# EAGLE board HYBRID_COMPUTER (EAGLE 7.7.0), part 1 of 2
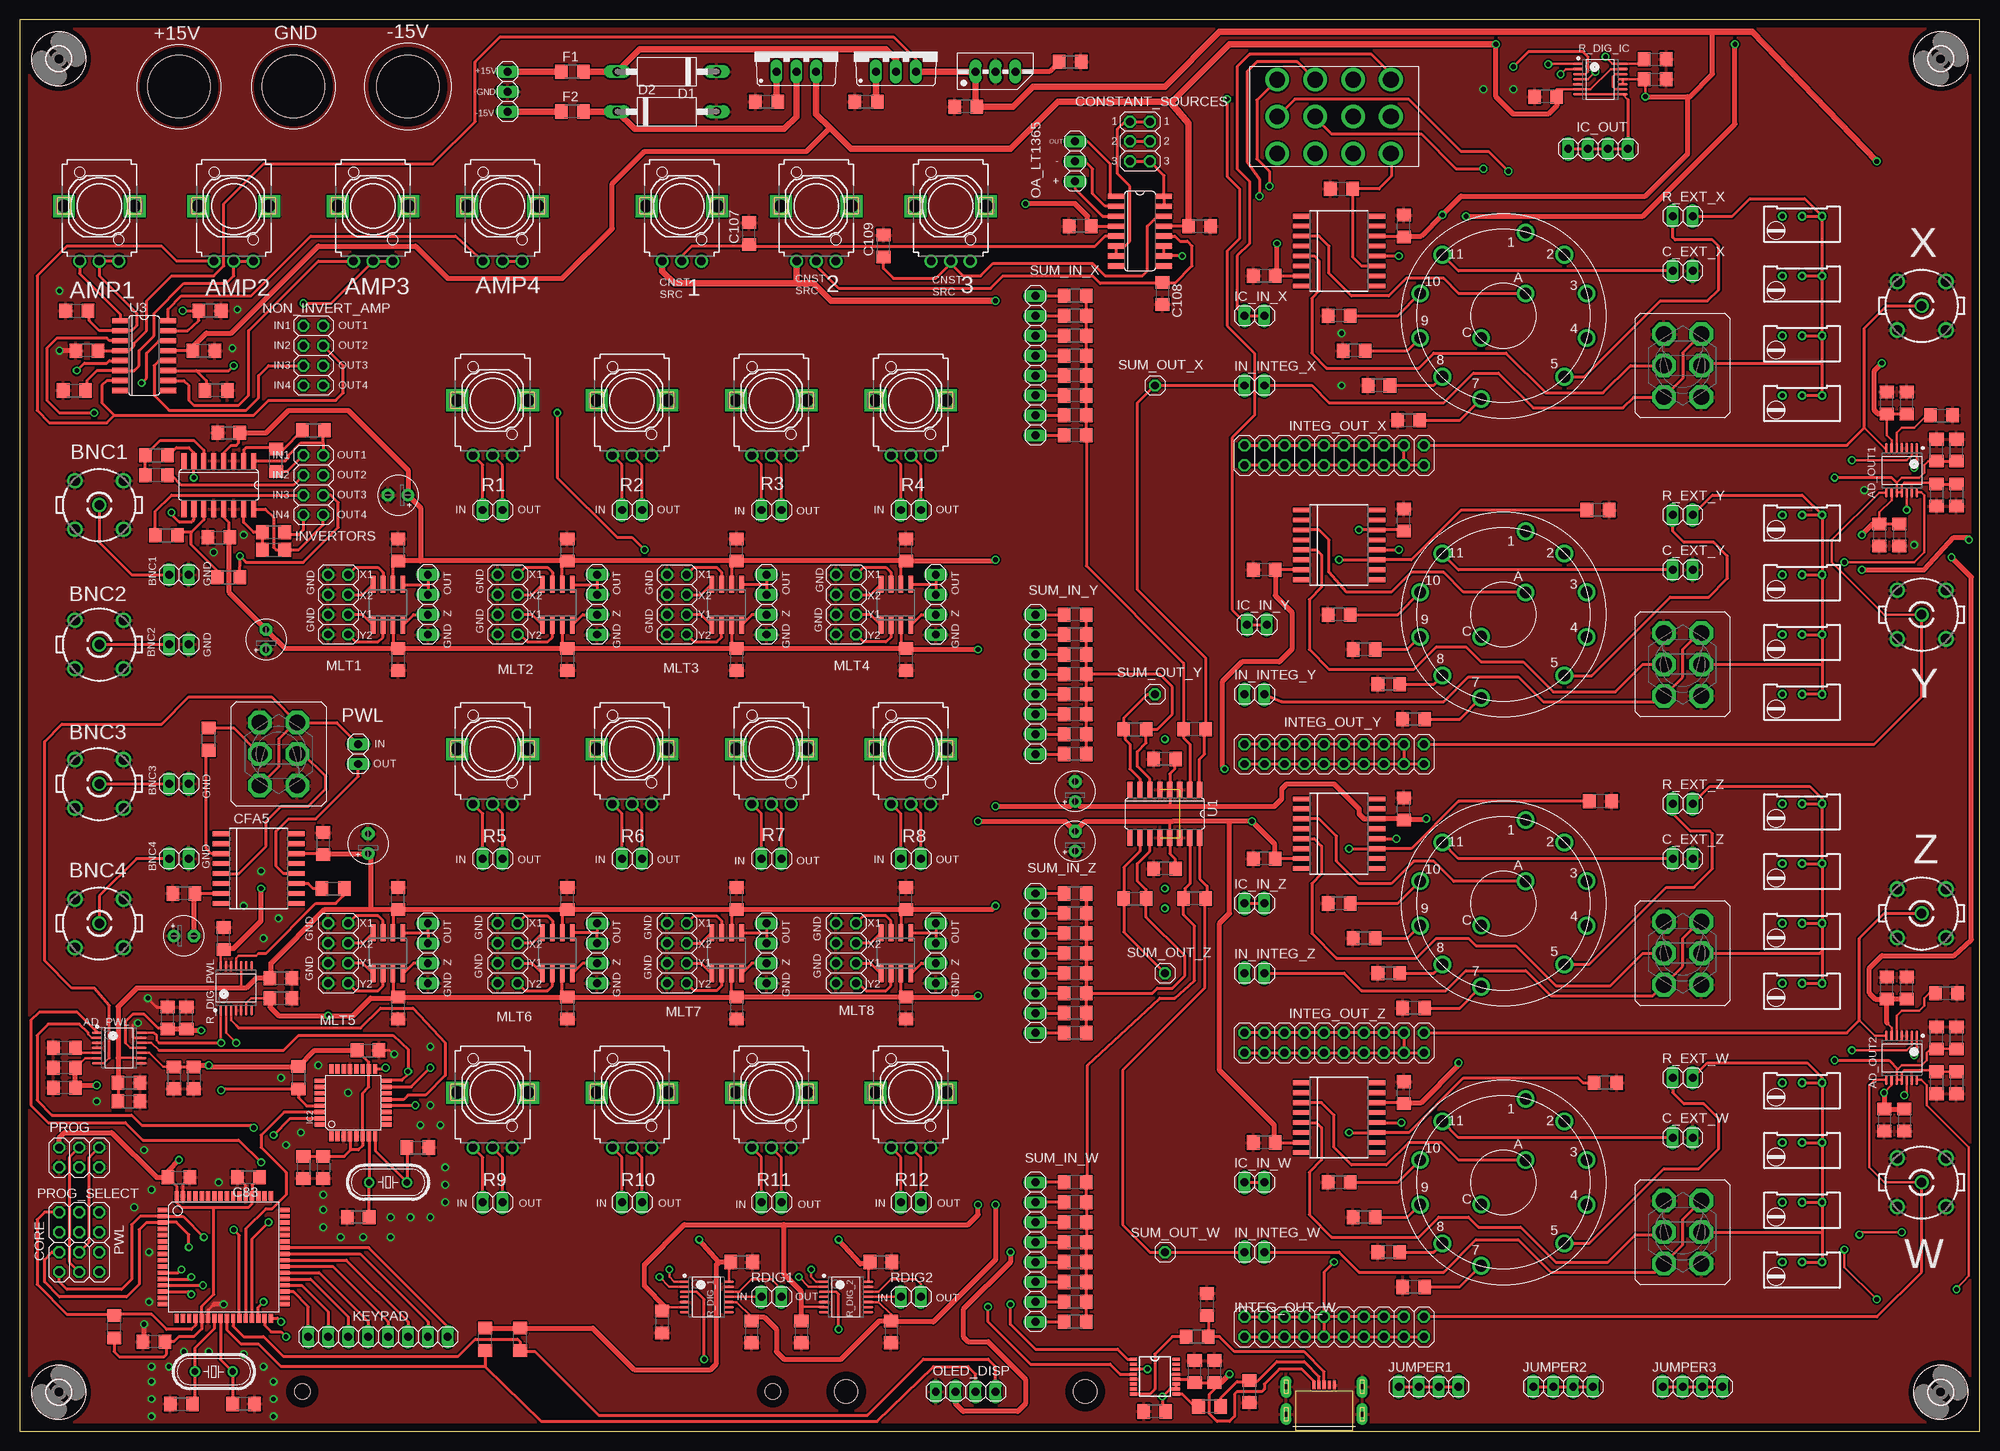
[diagram p2: board, top side]
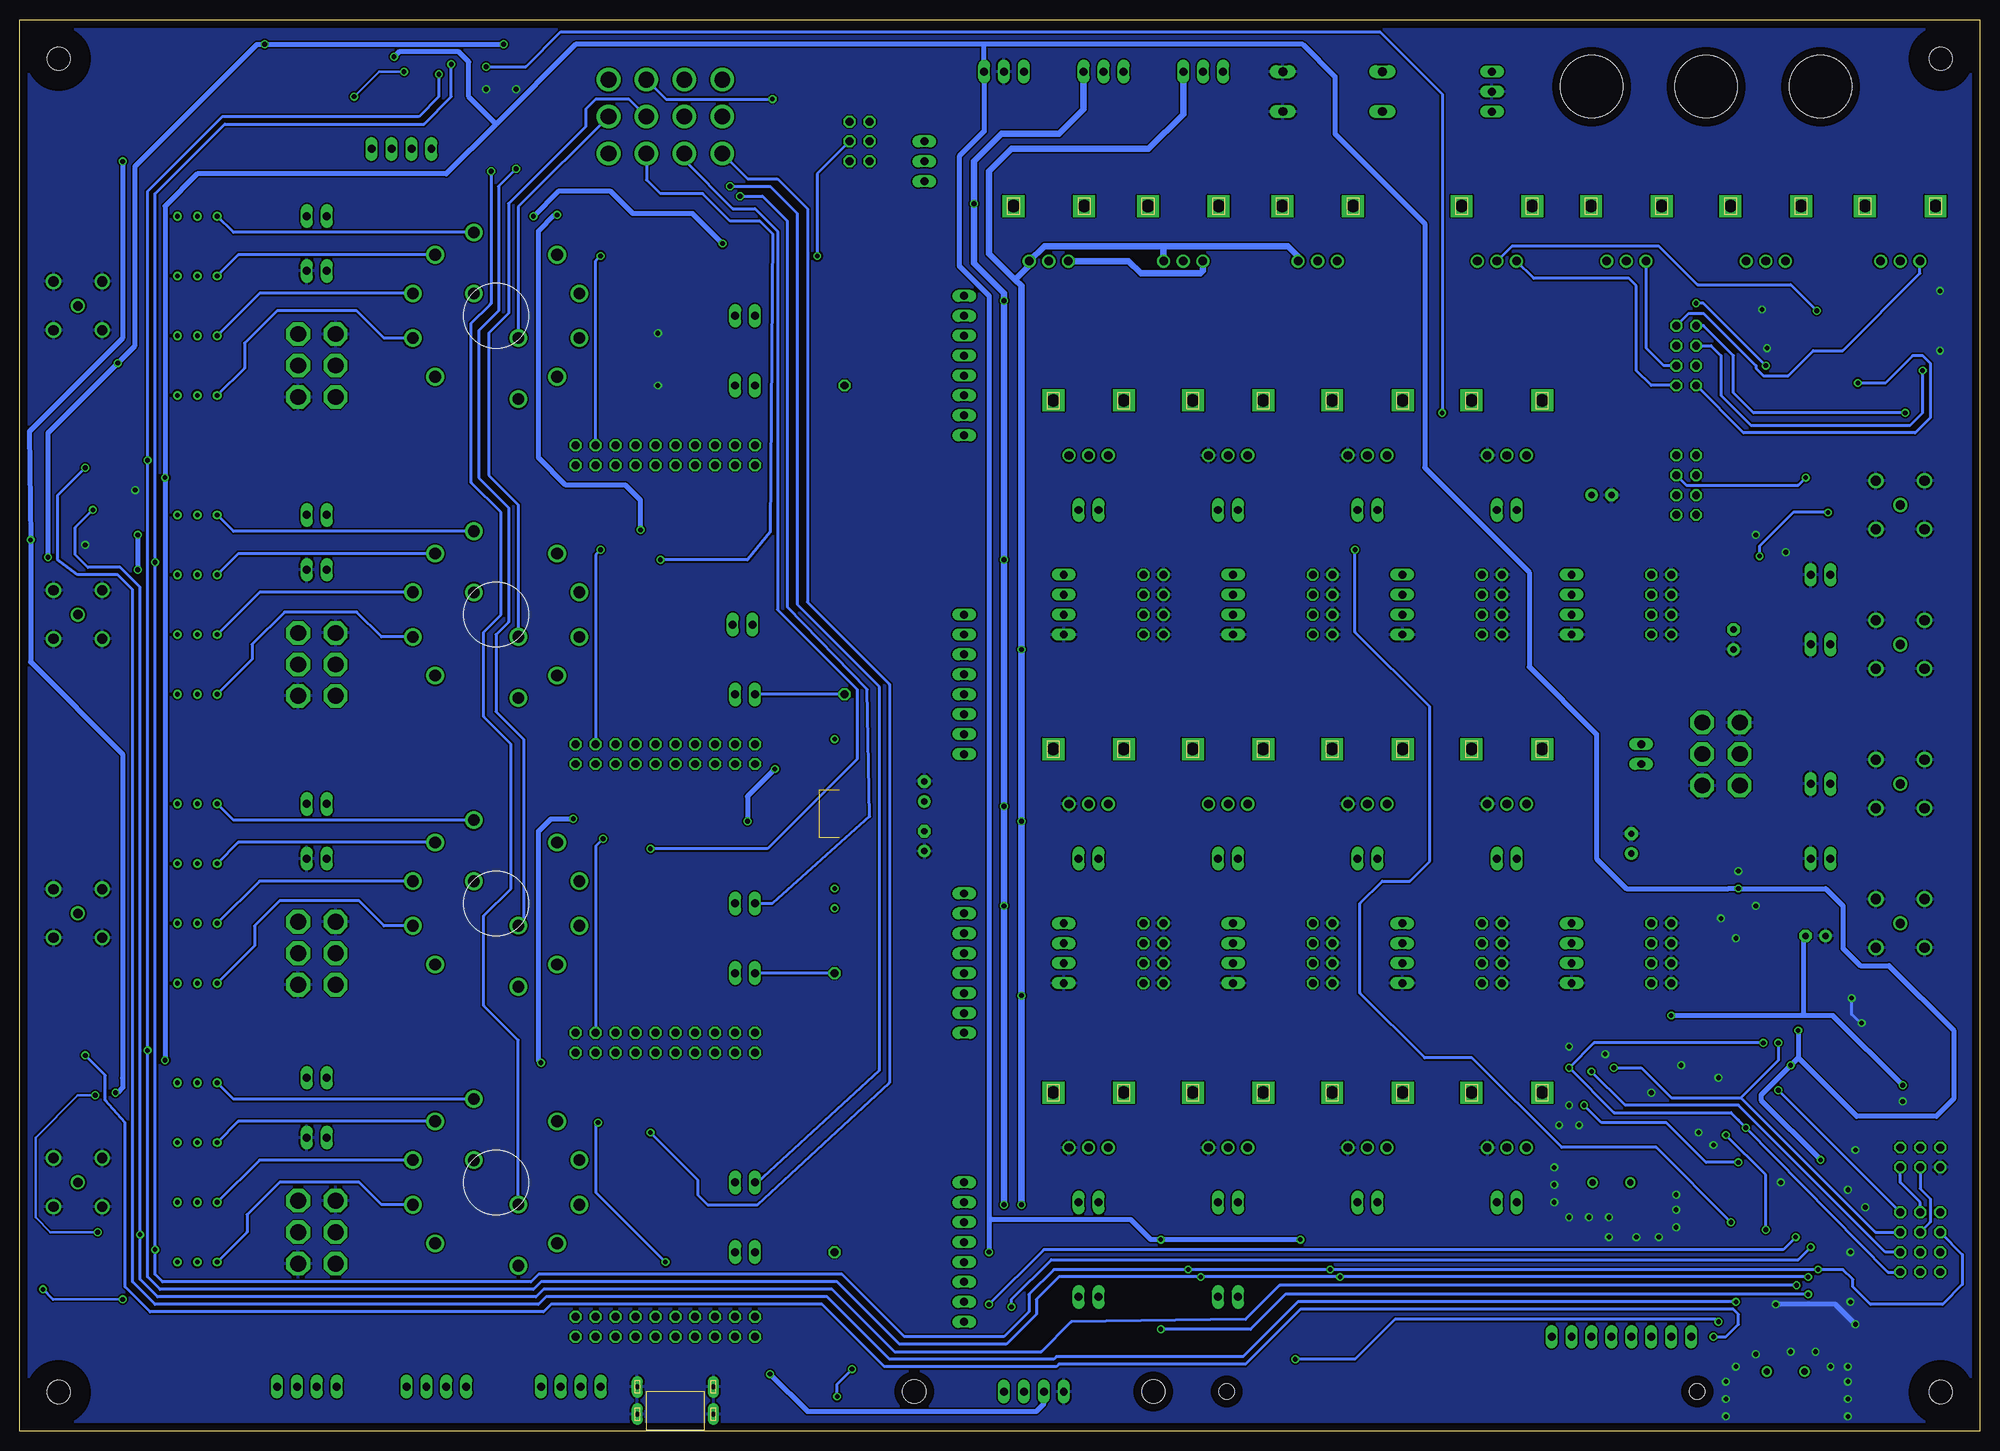
[diagram p3: board, bottom side, seen from below]

Size 250 x 180 mm. Coordinates in mm from the lower left corner, seen from the top.
Outline: 0,0 250,0 250,180 0,180 0,0
Copper layers (1*16): Top 0.035mm / dielectric 1.5mm / Bottom 0.035mm
Design rules "default": minimum track width 10mil, minimum drill 24mil, track to track 8mil, track to pad 8mil, pad to pad 8mil, via to via 8mil, smd to smd 8mil, copper to edge 40mil, drill to drill 8mil, minimum pad ring 10mil, minimum via ring 8mil, stop-mask expansion 4mil, vias tented up to drill 0mil, thermal gap 10mil
Holes 8 mm at 20.32,171.45 34.92,171.45 49.53,171.45
Holes 3 mm at 105.4,5.08 135.9,5.08
Holes 2 mm at 36.04,5.08 96.04,5.08

## Footprints (pad centres in the part's own frame; a part is rotated, then mirrored left to right if it is on the bottom)
TSSOP-14 = smd 1.3 x 0.35: 1 -2.825,1.95; 2 -2.825,1.3; 3 -2.825,0.65; 4 -2.825,0; 5 -2.825,-0.65; 6 -2.825,-1.3; 7 -2.825,-1.95; 8 2.825,-1.95; 9 2.825,-1.3; 10 2.825,-0.65; 11 2.825,0; 12 2.825,0.65; 13 2.825,1.3; 14 2.825,1.95
C_1206 = smd 1.6 x 1.8: 1 -1.4,0; 2 1.4,0
E2,5-5 = drill 0.813 pad 1.6: + -1.27,0 | drill 0.813 pad 1.6 octagon: - 1.27,0
1X02 = drill 1.016 long: 1 -1.27,0; 2 1.27,0
SOIC16R = smd 0.6 x 2.2: 1 -4.445,-4.775; 2 -3.175,-4.775; 3 -1.905,-4.775; 4 -0.635,-4.775; 5 0.635,-4.775; 6 1.905,-4.775; 7 3.175,-4.775; 8 4.445,-4.775; 9 4.445,4.8; 10 3.175,4.8; 11 1.905,4.8; 12 0.635,4.8; 13 -0.635,4.8; 14 -1.905,4.8; 15 -3.175,4.8; 16 -4.445,4.8
2X03 = drill 1.016 octagon: 1 -2.54,-1.27; 2 -2.54,1.27; 3 0,-1.27; 4 0,1.27; 5 2.54,-1.27; 6 2.54,1.27
DO15-12 = drill 1.118 long: A 6.35,0; C -6.35,0
FUSE_1206 = smd 1.6 x 1.803: 1 -1.422,0; 2 1.422,0
3,0 = hole 3: 0,0
TQFP64 = smd 1.194 x 0.559: 1 -7.8,6; 2 -7.8,5.2; 3 -7.8,4.4; 4 -7.8,3.6; 5 -7.8,2.8; 6 -7.8,2; 7 -7.8,1.2; 8 -7.8,0.4; 9 -7.8,-0.4; 10 -7.8,-1.2; 11 -7.8,-2; 12 -7.8,-2.8; 13 -7.8,-3.6; 14 -7.8,-4.4; 15 -7.8,-5.2; 16 -7.8,-6; 33 7.8,-6; 34 7.8,-5.2; 35 7.8,-4.4; 36 7.8,-3.6; 37 7.8,-2.8; 38 7.8,-2; 39 7.8,-1.2; 40 7.8,-0.4; 41 7.8,0.4; 42 7.8,1.2; 43 7.8,2; 44 7.8,2.8; 45 7.8,3.6; 46 7.8,4.4; 47 7.8,5.2; 48 7.8,6 | smd 0.559 x 1.194: 17 -6,-7.8; 18 -5.2,-7.8; 19 -4.4,-7.8; 20 -3.6,-7.8; 21 -2.8,-7.8; 22 -2,-7.8; 23 -1.2,-7.8; 24 -0.4,-7.8; 25 0.4,-7.8; 26 1.2,-7.8; 27 2,-7.8; 28 2.8,-7.8; 29 3.6,-7.8; 30 4.4,-7.8; 31 5.2,-7.8; 32 6,-7.8; 49 6,7.8; 50 5.2,7.8; 51 4.4,7.8; 52 3.6,7.8; 53 2.8,7.8; 54 2,7.8; 55 1.2,7.8; 56 0.4,7.8; 57 -0.4,7.8; 58 -1.2,7.8; 59 -2,7.8; 60 -2.8,7.8; 61 -3.6,7.8; 62 -4.4,7.8; 63 -5.2,7.8; 64 -6,7.8
TQFP32-08 = smd 1.27 x 0.559: 1 -4.293,2.8; 2 -4.293,2; 3 -4.293,1.2; 4 -4.293,0.4; 5 -4.293,-0.4; 6 -4.293,-1.2; 7 -4.293,-2; 8 -4.293,-2.8; 17 4.293,-2.8; 18 4.293,-2; 19 4.293,-1.2; 20 4.293,-0.4; 21 4.293,0.4; 22 4.293,1.2; 23 4.293,2; 24 4.293,2.8 | smd 0.559 x 1.27: 9 -2.8,-4.293; 10 -2,-4.293; 11 -1.2,-4.293; 12 -0.4,-4.293; 13 0.4,-4.293; 14 1.2,-4.293; 15 2,-4.293; 16 2.8,-4.293; 25 2.8,4.293; 26 2,4.293; 27 1.2,4.293; 28 0.4,4.293; 29 -0.4,4.293; 30 -1.2,4.293; 31 -2,4.293; 32 -2.8,4.293
SSOP16 = smd 0.914 x 0.406: 1 -2.718,2.223; 2 -2.718,1.587; 3 -2.718,0.953; 4 -2.718,0.318; 5 -2.718,-0.318; 6 -2.718,-0.953; 7 -2.718,-1.587; 8 -2.718,-2.223; 9 2.718,-2.223; 10 2.718,-1.587; 11 2.718,-0.953; 12 2.718,-0.318; 13 2.718,0.318; 14 2.718,0.953; 15 2.718,1.587; 16 2.718,2.223
78MXXS = drill 1.016 long: GND 0,-2.54; IN -2.54,-2.54; OUT 2.54,-2.54
1X04 = drill 1.016 long: 1 -3.81,0; 2 -1.27,0; 3 1.27,0; 4 3.81,0
2X10 = drill 1.016 octagon: 1 -11.43,-1.27; 2 -11.43,1.27; 3 -8.89,-1.27; 4 -8.89,1.27; 5 -6.35,-1.27; 6 -6.35,1.27; 7 -3.81,-1.27; 8 -3.81,1.27; 9 -1.27,-1.27; 10 -1.27,1.27; 11 1.27,-1.27; 12 1.27,1.27; 13 3.81,-1.27; 14 3.81,1.27; 15 6.35,-1.27; 16 6.35,1.27; 17 8.89,-1.27; 18 8.89,1.27; 19 11.43,-1.27; 20 11.43,1.27
2X04 = drill 1.016 octagon: 1 -3.81,-1.27; 2 -3.81,1.27; 3 -1.27,-1.27; 4 -1.27,1.27; 5 1.27,-1.27; 6 1.27,1.27; 7 3.81,-1.27; 8 3.81,1.27
1X08 = drill 1.016 long: 1 -8.89,0; 2 -6.35,0; 3 -3.81,0; 4 -1.27,0; 5 1.27,0; 6 3.81,0; 7 6.35,0; 8 8.89,0
SO8 = smd 0.6 x 2.2: 1 -1.905,-2.6; 2 -0.635,-2.6; 3 0.635,-2.6; 4 1.905,-2.6; 5 1.905,2.6; 6 0.635,2.6; 7 -0.635,2.6; 8 -1.905,2.6
1X03 = drill 1.016 long: 1 -2.54,0; 2 0,0; 3 2.54,0
HC49/S = drill 0.813: 1 -2.413,0; 2 2.413,0
RTRIM64W = drill 0.61: 1 1.27,-2.54; 2 1.27,0; 3 1.27,2.54
R_1206 = smd 1.6 x 1.803: 1 -1.422,0; 2 1.422,0
EVUFXL = drill 1.1 pad 1.676: 1 -2.5,-7; 2 0,-7; 3 2.5,-7 | drill 1.6 pad 2.8 square: M1 4.5,0; M2 -4.5,0
MAXIM_MAX5437EUD+_0 = smd 1.3 x 0.35: 1 -2.825,1.95; 2 -2.825,1.3; 3 -2.825,0.65; 4 -2.825,0; 5 -2.825,-0.65; 6 -2.825,-1.3; 7 -2.825,-1.95; 8 2.825,-1.95; 9 2.825,-1.3; 10 2.825,-0.65; 11 2.825,0; 12 2.825,0.65; 13 2.825,1.3; 14 2.825,1.95
KC25A9.501NLS = drill 1.5: P$01 -2.847,-10.625; P$02 -7.778,-7.778; P$03 -10.625,-2.847; P$04 -10.625,2.847; P$05 -7.778,7.778; P$07 2.847,10.625; P$08 7.778,7.778; P$09 10.625,2.847; P$10 10.625,-2.847; P$11 7.778,-7.778; P$A -2.828,-2.828; P$C 2.828,2.828
320-938 = drill 2.007 octagon: 1 -2.388,4.013; 2 -2.388,0; 3 -2.388,-4.013; 4 2.388,4.013; 5 2.388,0; 6 2.388,-4.013
1X01 = drill 1.016 octagon: 1 0,0
SO16 = smd 0.66 x 2.032: 1 -4.445,-3.073; 2 -3.175,-3.073; 3 -1.905,-3.073; 4 -0.635,-3.073; 5 0.635,-3.073; 6 1.905,-3.073; 7 3.175,-3.073; 8 4.445,-3.073; 9 4.445,3.073; 10 3.175,3.073; 11 1.905,3.073; 12 0.635,3.073; 13 -0.635,3.073; 14 -1.905,3.073; 15 -3.175,3.073; 16 -4.445,3.073
MICRO-USB-2 = smd 0.4 x 1.05: 1 -1.3,5.275; 2 -0.65,5.275; 3 0,5.275; 4 0.65,5.275; 5 1.3,5.275 | drill 0.6 pad 1.4 long: P$1 -4.85,5.05; P$2 -4.85,1.55; P$3 4.85,5.05; P$4 4.85,1.55
TO220BV = drill 1.016 long: D 0,-2.54; G -2.54,-2.54; S 2.54,-2.54
7401P3D9CQES = drill 2: P$01 7.245,-4.7; P$02 7.245,0; P$03 7.245,4.7; P$04 2.415,-4.7; P$05 2.415,0; P$06 2.415,4.7; P$07 -2.415,-4.7; P$08 -2.415,0; P$09 -2.415,4.7; P$10 -7.245,-4.7; P$11 -7.245,0; P$12 -7.245,4.7
B35N61 = drill 1.2: 1 0,0 | drill 1.3: 2 3.099,3.099; 3 -3.099,3.099; 4 -3.099,-3.099; 5 3.099,-3.099

## Placement (x,y rotation side)
AD_OUT1  AD7322  [TSSOP-14]  240.03,122.56 270 top
AD_OUT2  AD7322  [TSSOP-14]  240.03,47.62 270 top
AD_PWL  AD7322  [TSSOP-14]  12.7,48.9 0 top
C1  100p  [C_1206]  177.16,128.91 180 top
C2  10n  [C_1206]  173.35,133.35 180 top
C3  1u  [C_1206]  170.18,137.79 180 top
C4  10u  [C_1206]  168.28,142.24 180 top
C5  100n  [C_1206]  176.53,153.67 90 top
C6  100n  [C_1206]  158.75,147.32 180 top
C7  100n  [C_1206]  146.05,85.72 180 top
C8  100n  [C_1206]  146.05,71.75 180 top
C9  100n  [C_1206]  48.26,112.39 90 top
C10  100n  [C_1206]  48.26,98.42 270 top
C11  100n  [C_1206]  69.85,112.39 90 top
C12  100n  [C_1206]  69.85,98.42 270 top
C13  100n  [C_1206]  91.44,112.39 90 top
C14  100n  [C_1206]  91.44,98.42 270 top
C15  100n  [C_1206]  113.03,112.39 90 top
C16  100n  [C_1206]  113.03,98.42 270 top
C17  100n  [C_1206]  48.26,67.94 90 top
C18  100n  [C_1206]  48.26,53.98 270 top
C19  100n  [C_1206]  69.85,67.94 90 top
C20  100n  [C_1206]  69.85,53.98 270 top
C21  100n  [C_1206]  91.44,67.94 90 top
C22  100n  [C_1206]  91.44,53.98 270 top
C23  100n  [C_1206]  113.03,67.94 90 top
C24  100n  [C_1206]  113.03,53.98 270 top
C25  100n  [C_1206]  25.4,113.98 0 top
C26  100n  [C_1206]  26.67,127.32 0 top
C27  100n  [C_1206]  208.6,172.4 0 top
C28  100n  [C_1206]  194.63,170.18 180 top
C29  100n  [C_1206]  208.6,174.94 0 top
C30  100n  [C_1206]  33.34,57.78 0 top
C31  100n  [C_1206]  33.34,55.24 0 top
C32  100n  [C_1206]  26.04,62.87 90 top
C33  10u  [C_1206]  5.71,43.81 180 top
C34  10u  [C_1206]  13.97,44.45 0 top
C35  100n  [C_1206]  18.89,52.7 90 top
C36  10u  [C_1206]  21.27,52.7 90 top
C37  10u  [C_1206]  19.68,45.09 270 top
C38  100n  [C_1206]  22.23,45.09 270 top
C39  100n  [C_1206]  13.97,42.07 0 top
C40  100n  [C_1206]  5.71,46.35 180 top
C41  10u  [C_1206]  240.66,131.13 90 top
C42  10u  [C_1206]  239.71,114.3 270 top
C43  100n  [C_1206]  244.47,125.09 90 top
C44  10u  [C_1206]  247.01,125.09 90 top
C45  [C_1206]  244.47,119.38 270 top
C46  10u  [C_1206]  247.01,119.38 270 top
C47  100n  [C_1206]  237.17,114.3 270 top
C48  100n  [C_1206]  238.12,131.13 90 top
C49  10u  [C_1206]  238.12,56.52 90 top
C50  10u  [C_1206]  237.81,39.69 270 top
C51  100n  [C_1206]  244.47,50.16 90 top
C52  10u  [C_1206]  247.01,50.16 90 top
C53  10u  [C_1206]  244.47,44.45 270 top
C54  100n  [C_1206]  247.01,44.45 270 top
C55  100n  [C_1206]  240.35,39.69 270 top
C56  100n  [C_1206]  240.66,56.52 90 top
C57  680n  [C_1206]  5.71,48.9 180 top
C58  680n  [C_1206]  245.11,129.54 0 top
C59  680n  [C_1206]  245.75,55.88 0 top
C60  100p  [C_1206]  177.8,90.81 180 top
C61  10n  [C_1206]  174.62,95.25 180 top
C62  1u  [C_1206]  171.45,99.69 180 top
C63  10u  [C_1206]  168.28,104.14 180 top
C64  100n  [C_1206]  176.53,116.2 90 top
C65  100n  [C_1206]  158.75,109.86 180 top
C66  100p  [C_1206]  177.8,53.98 180 top
C67  10n  [C_1206]  174.62,58.42 180 top
C68  1u  [C_1206]  171.45,62.87 180 top
C69  10u  [C_1206]  168.28,67.31 180 top
C70  100n  [C_1206]  176.53,79.38 90 top
C71  100n  [C_1206]  158.75,73.03 180 top
C72  100p  [C_1206]  177.8,18.41 180 top
C73  10n  [C_1206]  174.62,22.86 180 top
C74  1u  [C_1206]  171.45,27.3 180 top
C75  10u  [C_1206]  168.28,31.75 180 top
C76  100n  [C_1206]  176.53,43.18 90 top
C77  100n  [C_1206]  158.75,36.83 180 top
C78  22p  [C_1206]  20.64,3.49 0 top
C79  22p  [C_1206]  28.57,3.49 180 top
C80  22p  [C_1206]  43.18,27.3 180 top
C81  22p  [C_1206]  50.8,36.2 0 top
C82  100n  [C_1206]  17.14,11.43 180 top
C83  100n  [C_1206]  29.21,32.38 180 top
C84  100n  [C_1206]  20.32,32.38 0 top
C85  100n  [C_1206]  38.73,33.66 270 top
C86  100n  [C_1206]  36.2,33.66 270 top
C87  100n  [C_1206]  44.45,48.58 0 top
C88  100n  [C_1206]  93.34,12.7 270 top
C89  100n  [C_1206]  81.92,13.97 270 top
C90  100n  [C_1206]  92.08,21.59 0 top
C91  100n  [C_1206]  111.12,12.7 270 top
C92  100n  [C_1206]  99.69,12.7 270 top
C93  100n  [C_1206]  109.86,21.59 0 top
C94  47p  [C_1206]  151.45,16.19 90 top
C95  47p  [C_1206]  156.84,5.08 270 top
C96  100n  [C_1206]  152.4,7.62 90 top
C97  4u7  [C_1206]  149.86,7.62 90 top
C98  100n  [C_1206]  144.78,2.54 180 top
C99  22u  [C_1206]  120.65,168.91 180 top
C100  100n  [C_1206]  133.99,174.62 0 top
C101  100n  [C_1206]  135.25,153.67 180 top
C102  100n  [C_1206]  150.5,153.67 0 top
C103  100n  [C_1206]  8.57,137.79 180 top
C104  100n  [C_1206]  23.5,137.79 0 top
C105  100n  [C_1206]  38.73,74.93 90 top
C106  100n  [C_1206]  20.95,68.58 180 top
C107  100n  [C_1206]  93.03,152.72 90 top
C108  100n  [C_1206]  145.73,145.1 270 top
C109  100n  [C_1206]  110.17,151.13 90 top
C110  10u  [E2,5-5]  134.62,81.6 90 top
C111  10u  [E2,5-5]  134.62,75.25 90 top
C112  10u  [E2,5-5]  31.43,100.97 90 top
C113  10u  [E2,5-5]  48.26,119.38 180 top
C114  10u  [E2,5-5]  44.45,74.93 90 top
C115  10u  [E2,5-5]  20.95,63.18 0 top
C_EXT_W  [1X02]  212.09,37.47 0 top
C_EXT_X  [1X02]  212.09,147.96 0 top
C_EXT_Y  [1X02]  212.09,109.86 0 top
C_EXT_Z  [1X02]  212.09,73.03 0 top
CFA1  AD844  [SOIC16R]  168.28,150.5 270 top
CFA2  AD844  [SOIC16R]  168.28,113.03 270 top
CFA3  AD844  [SOIC16R]  168.28,76.2 270 top
CFA4  AD844  [SOIC16R]  168.28,40.01 270 top
CFA5  AD844_SOIC16R  [SOIC16R]  30.48,71.75 270 top
CONSTANT_SOURCES  [2X03]  142.88,164.47 270 top
D1  TRANSIL  [DO15-12]  82.55,173.35 180 top
D2  TRANSIL  [DO15-12]  82.55,168.28 0 top
F1  63V/3A  [FUSE_1206]  70.48,173.35 0 top
F2  63V/3A  [FUSE_1206]  70.48,168.28 0 top
H1  MOUNT-HOLE3.0  [3,0]  5,5 0 top
H2  MOUNT-HOLE3.0  [3,0]  245,5 0 top
H3  MOUNT-HOLE3.0  [3,0]  245,175 0 top
H4  MOUNT-HOLE3.0  [3,0]  5,175 0 top
IC1  MEGA64-A  [TQFP64]  26.04,22.23 0 top
IC2  MEGA8-AI  [TQFP32-08]  42.55,41.91 90 top
IC3  FT230XS  [SSOP16]  144.78,6.99 0 top
IC4  7805  [78MXXS]  124.46,175.9 0 top
IC_IN_W  [1X02]  157.48,31.75 0 top
IC_IN_X  [1X02]  157.48,142.24 0 top
IC_IN_Y  [1X02]  157.8,102.87 0 top
IC_IN_Z  [1X02]  157.48,67.31 0 top
IC_OUT  [1X04]  201.29,163.51 0 top
IN_INTEG_W  [1X02]  157.48,22.86 0 top
IN_INTEG_X  [1X02]  157.48,133.35 0 top
IN_INTEG_Y  [1X02]  157.48,93.98 0 top
IN_INTEG_Z  [1X02]  157.48,58.42 0 top
INTEG_OUT_W  [2X10]  167.64,13.34 0 top
INTEG_OUT_X  [2X10]  167.64,124.46 0 top
INTEG_OUT_Y  [2X10]  167.64,86.36 0 top
INTEG_OUT_Z  [2X10]  167.64,49.53 0 top
INVERTORS  [2X04]  37.47,120.65 270 top
JP27  [1X02]  60.33,117.47 0 top
JP28  [1X02]  78.11,117.47 0 top
JP29  [1X02]  95.89,117.47 0 top
JP30  [1X02]  113.67,117.47 0 top
JP31  [1X02]  60.33,73.03 0 top
JP32  [1X02]  78.11,73.03 0 top
JP33  [1X02]  95.89,73.03 0 top
JP34  [1X02]  113.67,73.03 0 top
JP35  [1X02]  60.33,29.21 0 top
JP36  [1X02]  78.11,29.21 0 top
JP37  [1X02]  95.89,29.21 0 top
JP38  [1X02]  113.67,29.21 0 top
JP39  [1X02]  20.32,109.22 0 top
JP40  [1X02]  20.32,100.33 0 top
JP41  [1X02]  20.32,82.55 0 top
JP42  [1X02]  20.32,73.03 0 top
JP62  [2X03]  7.62,26.67 0 top
JP63  [2X03]  7.62,21.59 0 top
JUMPER1  [1X04]  179.71,5.71 0 top
JUMPER2  [1X04]  196.85,5.71 0 top
JUMPER3  [1X04]  213.36,5.71 0 top
KEYPAD  ADAFRUIT_3844  [1X08]  45.72,12.06 0 top
MLT1  AD633_SO8  [SO8]  46.99,105.41 0 top
MLT2  AD633_SO8  [SO8]  68.58,105.41 0 top
MLT3  AD633_SO8  [SO8]  90.17,105.41 0 top
MLT4  AD633_SO8  [SO8]  111.76,105.41 0 top
MLT5  AD633_SO8  [SO8]  46.99,60.96 0 top
MLT6  AD633_SO8  [SO8]  68.58,60.96 0 top
MLT7  AD633_SO8  [SO8]  90.17,60.96 0 top
MLT8  AD633_SO8  [SO8]  111.76,60.96 0 top
MULT_IN_1  [2X04]  40.64,105.41 270 top
MULT_IN_2  [2X04]  62.23,105.41 270 top
MULT_IN_3  [2X04]  83.82,105.41 270 top
MULT_IN_4  [2X04]  105.41,105.41 270 top
MULT_IN_5  [2X04]  40.64,60.96 270 top
MULT_IN_6  [2X04]  62.23,60.96 270 top
MULT_IN_7  [2X04]  83.82,60.96 270 top
MULT_IN_8  [2X04]  105.41,60.96 270 top
MULT_OUT_1  [1X04]  52.07,105.41 270 top
MULT_OUT_2  [1X04]  73.66,105.41 270 top
MULT_OUT_3  [1X04]  95.25,105.41 270 top
MULT_OUT_4  [1X04]  116.84,105.41 270 top
MULT_OUT_5  [1X04]  52.07,60.96 270 top
MULT_OUT_6  [1X04]  73.66,60.96 270 top
MULT_OUT_7  [1X04]  95.25,60.96 270 top
MULT_OUT_8  [1X04]  116.84,60.96 270 top
NON_INVERT_AMP  [2X04]  37.47,137.16 270 top
OA_LT1365  [1X03]  134.62,161.93 270 top
OLED_DISP  I2C_SSH1106  [1X04]  120.65,5.08 0 top
PROG  [2X03]  7.62,34.92 0 top
PWL  [1X02]  43.18,86.36 270 top
PWR  [1X03]  62.23,170.81 270 top
Q1  16MHz  [HC49/S]  24.77,7.62 180 top
Q2  16MHz  [HC49/S]  46.99,31.75 180 top
R1  20k  [RTRIM64W]  227.33,153.67 90 top
R2  20k  [RTRIM64W]  227.33,146.05 90 top
R3  20k  [RTRIM64W]  227.33,138.43 90 top
R4  200k  [RTRIM64W]  227.33,130.81 90 top
R5  10k  [R_1206]  134.62,144.78 0 top
R6  10k  [R_1206]  134.62,142.24 0 top
R7  10k  [R_1206]  134.62,139.7 0 top
R8  10k  [R_1206]  134.62,137.16 0 top
R9  10k  [R_1206]  134.62,134.62 0 top
R10  10k  [R_1206]  134.62,132.08 0 top
R11  10k  [R_1206]  134.62,129.54 0 top
R12  10k  [R_1206]  134.62,127 0 top
R13  10k  [R_1206]  149.86,89.53 0 top
R14  10k  [R_1206]  134.62,104.14 0 top
R15  10k  [R_1206]  134.62,101.6 0 top
R16  10k  [R_1206]  134.62,99.06 0 top
R17  10k  [R_1206]  134.62,96.52 0 top
R18  10k  [R_1206]  134.62,93.98 0 top
R19  10k  [R_1206]  134.62,91.44 0 top
R20  10k  [R_1206]  134.62,88.9 0 top
R21  10k  [R_1206]  134.62,86.36 0 top
R22  10k  [R_1206]  142.24,89.53 180 top
R23  10k  [R_1206]  134.62,68.58 0 top
R24  10k  [R_1206]  134.62,66.04 0 top
R25  10k  [R_1206]  134.62,63.5 0 top
R26  10k  [R_1206]  134.62,60.96 0 top
R27  10k  [R_1206]  134.62,58.42 0 top
R28  10k  [R_1206]  134.62,55.88 0 top
R29  10k  [R_1206]  134.62,53.34 0 top
R30  10k  [R_1206]  134.62,50.8 0 top
R31  10k  [R_1206]  142.24,67.94 180 top
R32  10k  [R_1206]  134.62,31.75 0 top
R33  10k  [R_1206]  134.62,29.21 0 top
R34  10k  [R_1206]  134.62,26.67 0 top
R35  10k  [R_1206]  134.62,24.13 0 top
R36  10k  [R_1206]  134.62,21.59 0 top
R37  10k  [R_1206]  134.62,19.05 0 top
R38  10k  [R_1206]  134.62,16.51 0 top
R39  10k  [R_1206]  134.62,13.97 0 top
R40  10k  [R_1206]  149.86,67.94 0 top
R41  10k  [R_1206]  24.13,88.27 270 top
R42  20k,  [RTRIM64W]  227.33,115.57 90 top
R43  20k  [RTRIM64W]  227.33,107.95 90 top
R44  20k  [RTRIM64W]  227.33,100.33 90 top
R45  200k  [RTRIM64W]  227.33,92.71 90 top
R46  20k  [RTRIM64W]  227.33,78.74 90 top
R47  20k  [RTRIM64W]  227.33,71.12 90 top
R48  20k  [RTRIM64W]  227.33,63.5 90 top
R49  200k  [RTRIM64W]  227.33,55.88 90 top
R50  20k  [RTRIM64W]  227.33,43.18 90 top
R51  20k  [RTRIM64W]  227.33,35.56 90 top
R52  20k  [RTRIM64W]  227.33,27.94 90 top
R53  200k  [RTRIM64W]  227.33,20.32 90 top
R54  10k  [R_1206]  12.06,13.34 270 top
R55  10k  [R_1206]  35.56,45.09 90 top
R56  27R  [R_1206]  150.18,12.06 0 top
R57  27R  [R_1206]  151.76,3.17 0 top
R58  4k7  [R_1206]  63.82,11.75 270 top
R59  4k7  [R_1206]  59.37,11.75 270 top
R60  10k  [R_1206]  32.7,123.83 270 top
R61  10k  [R_1206]  37.47,127.64 180 top
R62  10k  [R_1206]  17.46,121.92 0 top
R63  10k  [R_1206]  17.46,124.46 180 top
R64  10k  [R_1206]  18.73,114.26 180 top
R65  10k  [R_1206]  26.67,108.9 180 top
R66  10k  [R_1206]  32.38,114.62 0 top
R67  10k  [R_1206]  32.38,112.39 180 top
R68  10k  [R_1206]  7.3,142.88 180 top
R69  10k  [R_1206]  6.99,132.72 180 top
R70  10k  [R_1206]  25.08,132.72 0 top
R71  10k  [R_1206]  24.29,142.88 0 top
R72  2M2  [R_1206]  107.95,169.54 180 top
R73  2M2  [R_1206]  95.25,169.54 180 top
R74  EVUF3L  [EVUFXL]  60.33,131.44 0 top
R75  EVUF3L  [EVUFXL]  78.11,131.44 0 top
R76  EVUF3L  [EVUFXL]  95.89,131.44 0 top
R77  EVUF3L  [EVUFXL]  113.67,131.44 0 top
R78  EVUF3L  [EVUFXL]  60.33,87 0 top
R79  EVUF3L  [EVUFXL]  78.11,87 0 top
R80  EVUF3L  [EVUFXL]  95.89,87 0 top
R81  EVUF3L  [EVUFXL]  113.67,87 0 top
R82  EVUF3L  [EVUFXL]  60.33,43.18 0 top
R83  EVUF3L  [EVUFXL]  78.11,43.18 0 top
R84  EVUF3L  [EVUFXL]  95.89,43.18 0 top
R85  EVUF3L  [EVUFXL]  113.67,43.18 0 top
R86  EVUF3L  [EVUFXL]  84.45,156.21 0 top
R87  EVUF3L  [EVUFXL]  101.6,156.21 0 top
R88  EVUF3L  [EVUFXL]  118.75,156.21 0 top
R89  EVUF3L  [EVUFXL]  27.3,156.21 0 top
R90  EVUF3L  [EVUFXL]  61.59,156.21 0 top
R91  EVUF3L  [EVUFXL]  10.16,156.21 0 top
R92  EVUF3L  [EVUFXL]  45.09,156.21 0 top
R93  100R  [R_1206]  40.01,69.22 180 top
R94  500k  [R_1206]  168.59,158.43 180 top
R95  500k  [R_1206]  201.29,117.47 0 top
R96  500k  [R_1206]  201.61,80.33 0 top
R97  500k  [R_1206]  202.25,44.45 0 top
R_DIG_1  MAXIM_MAX5437EUD+MAXIM_MAX5437EUD+_0_0  [MAXIM_MAX5437EUD+_0]  87.63,17.14 0 top
R_DIG_2  MAXIM_MAX5437EUD+MAXIM_MAX5437EUD+_0_0  [MAXIM_MAX5437EUD+_0]  105.41,17.14 0 top
R_DIG_IC  MAXIM_MAX5437EUD+MAXIM_MAX5437EUD+_0_0  [MAXIM_MAX5437EUD+_0]  201.61,172.4 0 top
R_DIG_PWL  MAXIM_MAX5437EUD+MAXIM_MAX5437EUD+_0_0  [MAXIM_MAX5437EUD+_0]  27.62,56.52 90 top
R_EXT_W  [1X02]  212.09,45.09 0 top
R_EXT_X  [1X02]  212.09,154.94 0 top
R_EXT_Y  [1X02]  212.09,116.84 0 top
R_EXT_Z  [1X02]  212.09,80.01 0 top
RDIG1  [1X02]  95.89,17.14 0 top
RDIG2  [1X02]  113.67,17.14 0 top
S1  KC25A9.501NLS  [KC25A9.501NLS]  189.23,142.24 180 top
S2  KC25A9.501NLS  [KC25A9.501NLS]  189.23,104.14 180 top
S3  KC25A9.501NLS  [KC25A9.501NLS]  189.23,67.31 180 top
S4  KC25A9.501NLS  [KC25A9.501NLS]  189.23,31.75 180 top
S5  [320-938]  212.09,135.89 180 top
S6  [320-938]  212.09,97.79 180 top
S7  [320-938]  212.09,60.96 180 top
S8  [320-938]  212.09,25.4 180 top
S9  [320-938]  33.02,86.36 0 top
SUM_IN_W  [1X08]  129.54,22.86 270 top
SUM_IN_X  [1X08]  129.54,135.89 270 top
SUM_IN_Y  [1X08]  129.54,95.25 270 top
SUM_IN_Z  [1X08]  129.54,59.69 270 top
SUM_OUT_W  [1X01]  146.05,22.86 0 top
SUM_OUT_X  [1X01]  144.78,133.35 0 top
SUM_OUT_Y  [1X01]  144.78,93.98 0 top
SUM_OUT_Z  [1X01]  146.05,58.42 0 top
U1  LT1365CS  [SO16]  146.05,78.74 180 top
U2  LT1365CS  [SO16]  25.4,120.65 180 top
U3  LT1365CS  [SO16]  15.88,137.16 270 top
U4  LT1365CS  [SO16]  142.88,153.03 270 top
U$1  MICRO-USBV2  [MICRO-USB-2]  166.37,0.64 0 top
U$2  IRF1010  [TO220BV]  99.06,175.9 0 top
U$3  IRF5305  [TO220BV]  111.76,175.9 0 top
U$4  7401P3D9CQES  [7401P3D9CQES]  167.64,167.64 0 top
X1  BN35N61  [B35N61]  10.16,118.11 0 top
X2  BN35N61  [B35N61]  10.16,100.33 0 top
X3  BN35N61  [B35N61]  10.16,82.55 0 top
X4  BN35N61  [B35N61]  10.16,64.77 0 top
X5  BN35N61  [B35N61]  242.57,143.51 0 top
X6  BN35N61  [B35N61]  242.57,104.14 0 top
X7  BN35N61  [B35N61]  242.57,66.04 0 top
X8  BN35N61  [B35N61]  242.57,31.75 0 top